# EAGLE schematic 4_serial_LSA (EAGLE 9.2.0)
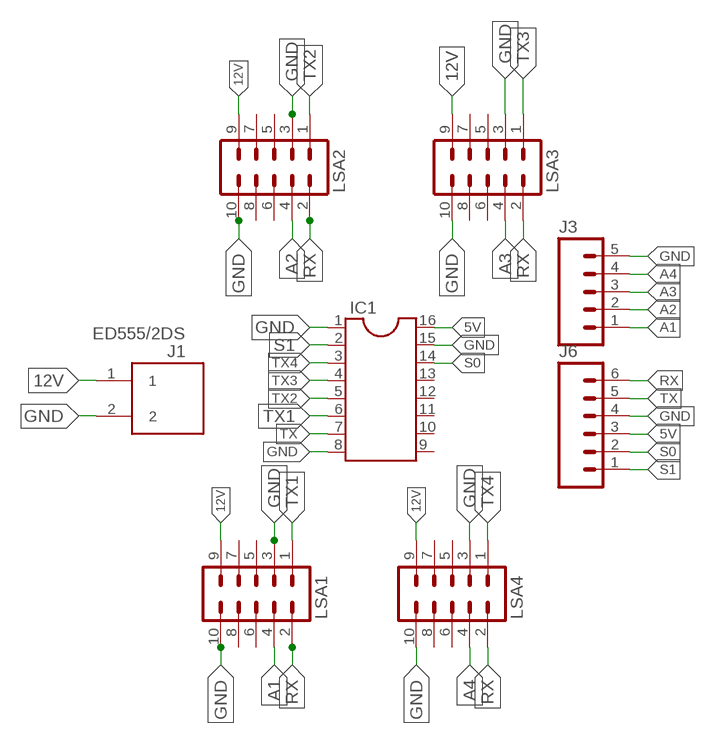
[diagram p0: schematic, sheet 1]

## Parts
IC1  DIL16S  [SOCKET-16]
J1  ED555/2DS  [ED555/2DS]
J3  M05PTH  [1X05]
J6  M06SILK_FEMALE_PTH  [1X06]
LSA1  M05X2SHD_LOCK  [2X5-SHROUDED_LOCK]
LSA2  M05X2SHD_LOCK  [2X5-SHROUDED_LOCK]
LSA3  M05X2SHD_LOCK  [2X5-SHROUDED_LOCK]
LSA4  M05X2SHD_LOCK  [2X5-SHROUDED_LOCK]

## Nets
5V: IC1.16 J6.3
12V: J1.1 LSA1.9 LSA2.9 LSA3.9 LSA4.9
A1: J3.1 LSA1.4
A2: J3.2 LSA2.4
A3: J3.3 LSA3.4
A4: J3.4 LSA4.4
GND: IC1.1 IC1.8 IC1.15 J1.2 J3.5 J6.4 LSA1.3 LSA1.10 LSA2.3 LSA2.10 LSA3.3 LSA3.10 LSA4.3 LSA4.10
RX: J6.6 LSA1.2 LSA2.2 LSA3.2 LSA4.2
S0: IC1.14 J6.2
S1: IC1.2 J6.1
TX: IC1.7 J6.5
TX1: IC1.6 LSA1.1
TX2: IC1.5 LSA2.1
TX3: IC1.4 LSA3.1
TX4: IC1.3 LSA4.1
Unconnected: IC1.9 IC1.10 IC1.11 IC1.12 IC1.13 LSA1.5 LSA1.6 LSA1.7 LSA1.8 LSA2.5 LSA2.6 LSA2.7 LSA2.8 LSA3.5 LSA3.6 LSA3.7 LSA3.8 LSA4.5 LSA4.6 LSA4.7 LSA4.8

## Library data of the parts
IC1 = ic-package:DIL16: Dual In Line / Socket
J1 = DC_LOAD_AU:ED555/2DS: 2-Pin Terminal Block 3.5mm pitch 6A
J3 = SparkFun-Connectors:M05: Header 5 Standard 5-pin 0.1" header. Use with straight break away headers (SKU : PRT-00116), right angle break away headers (PRT-00553), swiss pins (PRT-00743), machine pins (PRT-00117), and female headers (PRT-00115). Molex polarized connector foot print use with SKU : PRT-08230 with associated crimp pins and housings.; SPICEPREFIX: X
J6 = SparkFun-Connectors:M06: Header 6 Standard 6-pin 0.1" header. Use with straight break away headers (SKU : PRT-00116), right angle break away headers (PRT-00553), swiss pins (PRT-00743), machine pins (PRT-00117), and female headers (PRT-00115). Molex polarized connector foot print use with SKU : PRT-08094 with associated crimp pins and housings. NOTES ON THE VARIANTS LOCK and LOCK_LONGPADS... This footprint was designed to help hold the alignment of a through-hole component (i.e. 6-pin header) while soldering it into place. You may notice that each hole has been shifted either up or down by 0.005 of an inch from it's more standard position (which is a perfectly straight line). This slight alteration caused the pins (the squares in the middle) to touch the edges of the holes. Because they are alternating, it causes a "brace" to hold the component in place. 0.005 has proven to be the perfect amount of "off-center" position when using our standard breakaway headers. Although looks a little odd when you look at the bare footprint, once you have a header in there, the alteration is very hard to notice. Also,if you push a header all the way into place, it is covered up entirely on the bottom side. This idea of altering the position of holes to aid alignment will be further integrated into the Sparkfun Library for other footprints. It can help hold any component with 3 or more connection pins.; PROD_ID: CONN-08437
LSA1-LSA4 = SparkFun-Connectors:M05X2: Header 5x2 Standard 10-pin dual row 0.1" header. Commonly used with AVR-ISP. Use with Spark Fun Electronics SKU: PRT-00778

## Net classes
0 default: width 0.305 mm, drill 0.508 mm, clearance 0.305 mm